# EAGLE design microSAT v6.0.1 (EAGLE 5.11)
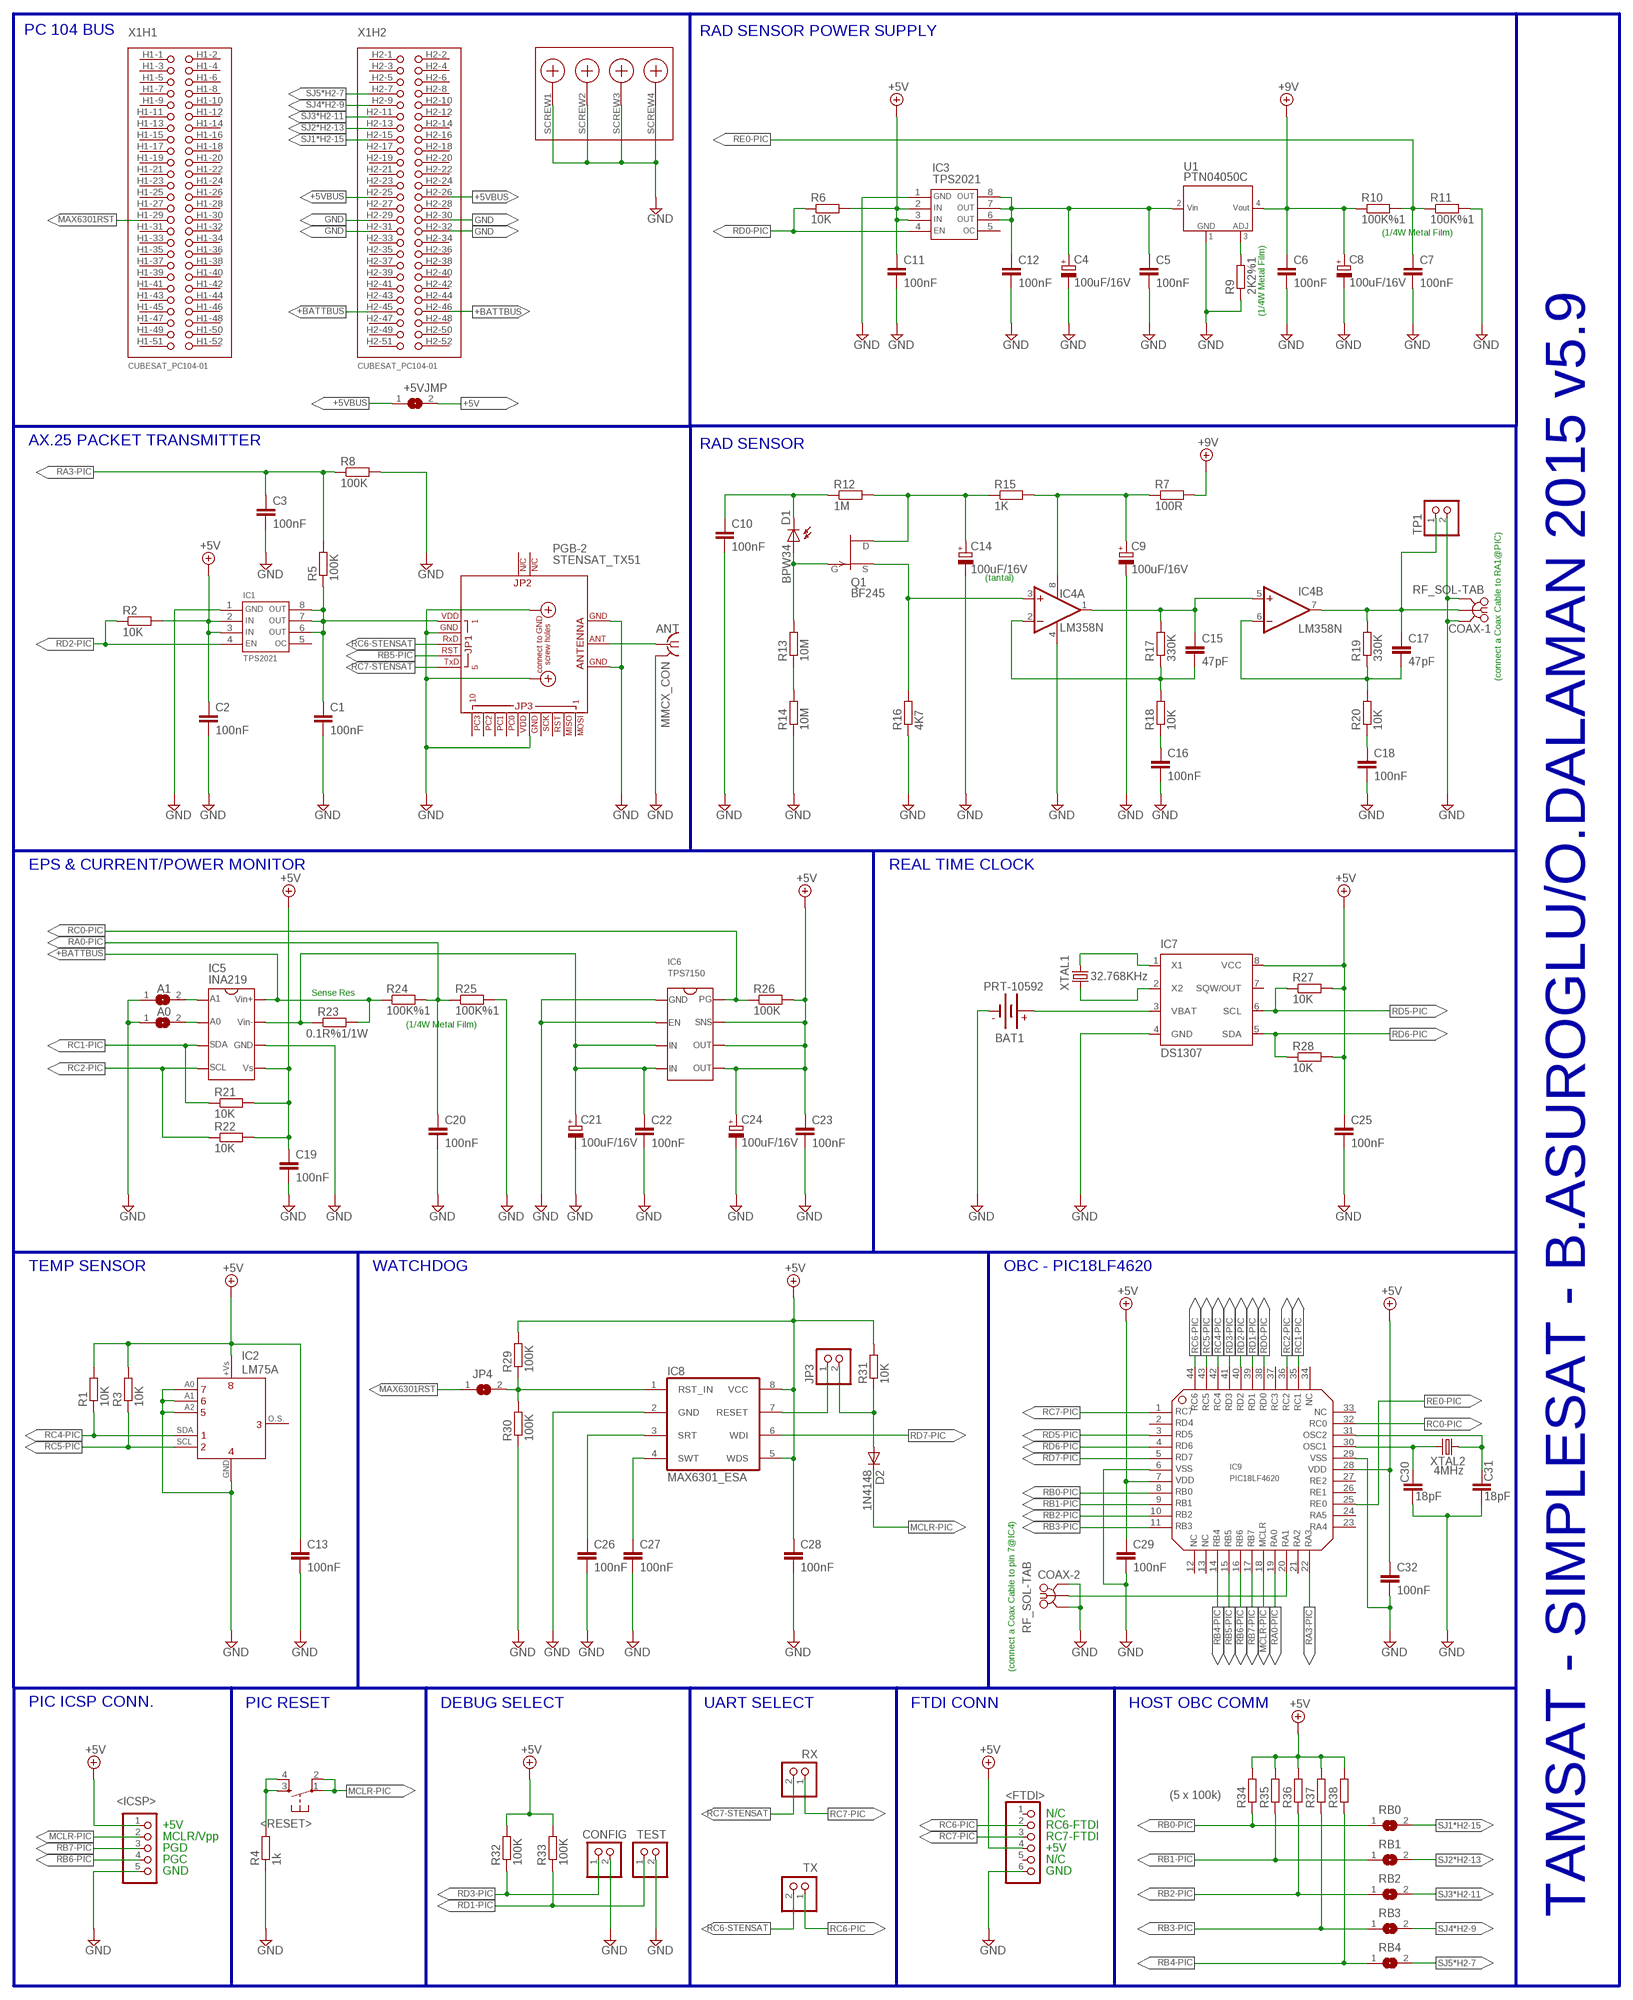
[diagram p0: schematic, sheet 1]

## Parts
+5VJMP  SJ  [SJ]
<FTDI>  PINHD-1X6-SP/90  [1X06/90]
<ICSP>  PINHD-1X5/90  [1X05/90]
<RESET>  TAC_SWITCHPTH  [TACTILE-PTH]
A0  SJ  [SJ]
A1  SJ  [SJ]
ANT  MMCX_CON  [MMCX]
BAT1  PRT-10592  BATTERY12MM  [BATTCON_12MM]
C1  100nF  C-EUC0805  [C0805]
C2  100nF  C-EUC0805  [C0805]
C3  100nF  C-EUC0805  [C0805]
C4  100uF/16V  CPOL-EUCT6032  [CT6032]
C5  100nF  C-EUC0805  [C0805]
C6  100nF  C-EUC0805  [C0805]
C7  100nF  C-EUC0805  [C0805]
C8  100uF/16V  CPOL-EUCT6032  [CT6032]
C9  100uF/16V  CPOL-EUCT6032  [CT6032]
C10  100nF  C-EUC0805  [C0805]
C11  100nF  C-EUC0805  [C0805]
C12  100nF  C-EUC0805  [C0805]
C13  100nF  C-EUC0805  [C0805]
C14  100uF/16V  CPOL-EUCT6032  [CT6032]
C15  47pF  C-EUC0805  [C0805]
C16  100nF  C-EUC0805  [C0805]
C17  47pF  C-EUC0805  [C0805]
C18  100nF  C-EUC0805  [C0805]
C19  100nF  C-EUC0805  [C0805]
C20  100nF  C-EUC0805  [C0805]
C21  100uF/16V  CPOL-EUCT6032  [CT6032]
C22  100nF  C-EUC0805  [C0805]
C23  100nF  C-EUC0805  [C0805]
C24  100uF/16V  CPOL-EUCT6032  [CT6032]
C25  100nF  C-EUC0805  [C0805]
C26  100nF  C-EUC0805  [C0805]
C27  100nF  C-EUC0805  [C0805]
C28  100nF  C-EUC0805  [C0805]
C29  100nF  C-EUC0805  [C0805]
C30  18pF  C-EUC0805K  [C0805K]
C31  18pF  C-EUC0805K  [C0805K]
C32  100nF  C-EUC0805  [C0805]
COAX-1  RF_SOL-TAB  [RF_SOL-TAB]
COAX-2  RF_SOL-TAB  [RF_SOL-TAB]
CONFIG  PINHD-1X2-SP/90  [1X02/90]
D1  BPW34  BPW32  [BPW32]
D2  1N4148  CGRM4001-G  [SOD-123_MINI-SMA]
IC1  TPS2021  [SOIC8]
IC2  LM75A  [SOIC8]
IC3  TPS2021  [SOIC8]
IC4  LM358N  [DIL08]
IC5  INA219  [SOIC8]
IC6  TPS7150  [SOIC8]
IC7  DS1307  [SOIC8]
IC8  MAX6301_ESA  [SO08]
IC9  PIC18LF4620  [TQFP44]
JP3  PINHD-1X2-SP  [1X02]
JP4  SJ  [SJ]
PGB-2  STENSAT_TX51  [STENSAT_TX51]
Q1  BF245  [TO92]
R1  10K  R-EU_R0805  [R0805]
R2  10K  R-EU_R0805  [R0805]
R3  10K  R-EU_R0805  [R0805]
R4  1k  R-EU_R0805  [R0805]
R5  100K  R-EU_M0805  [M0805]
R6  10K  R-EU_R0805  [R0805]
R7  100R  R-EU_M0805  [M0805]
R8  100K  R-EU_M0805  [M0805]
R9  2K2%1  R-EU_MELF0204W  [MINI_MELF-0204W]
R10  100K%1  R-EU_MELF0204R  [MINI_MELF-0204R]
R11  100K%1  R-EU_MELF0204R  [MINI_MELF-0204R]
R12  1M  R-EU_M0805  [M0805]
R13  10M  R-EU_M0805  [M0805]
R14  10M  R-EU_M0805  [M0805]
R15  1K  R-EU_M0805  [M0805]
R16  4K7  R-EU_M0805  [M0805]
R17  330K  R-EU_M0805  [M0805]
R18  10K  R-EU_M0805  [M0805]
R19  330K  R-EU_M0805  [M0805]
R20  10K  R-EU_M0805  [M0805]
R21  10K  R-EU_M0805  [M0805]
R22  10K  R-EU_M0805  [M0805]
R23  0.1R%1/1W  R-EU_R5025  [R5025]
R24  100K%1  R-EU_M0805  [M0805]
R25  100K%1  R-EU_M0805  [M0805]
R26  100K  R-EU_M0805  [M0805]
R27  10K  R-EU_M0805  [M0805]
R28  10K  R-EU_M0805  [M0805]
R29  100K  R-EU_M0805  [M0805]
R30  100K  R-EU_M0805  [M0805]
R31  10K  R-EU_M0805  [M0805]
R32  100K  R-EU_M0805  [M0805]
R33  100K  R-EU_M0805  [M0805]
R34  R-EU_M0805  [M0805]
R35  R-EU_M0805  [M0805]
R36  R-EU_M0805  [M0805]
R37  R-EU_M0805  [M0805]
R38  R-EU_M0805  [M0805]
RB0  SJ  [SJ]
RB1  SJ  [SJ]
RB2  SJ  [SJ]
RB3  SJ  [SJ]
RB4  SJ  [SJ]
RX  PINHD-1X2-SP/90  [1X02/90]
TEST  PINHD-1X2-SP/90  [1X02/90]
TP1  PINHD-1X2-SP  [1X02]
TX  PINHD-1X2-SP/90  [1X02/90]
U1  PTN04050C  [PTN04050C]
X1  CUBESAT_PC104-01  [PC104-PLUS]
XTAL1  32.768KHz  CRYSTALTC26H  [TC26H]
XTAL2  4MHz  CRYSTALHC49S  [HC49/S]

## Nets
+5V: +5VJMP.2 <FTDI>.4 <ICSP>.1 C2.1 C11.1 C13.1 C19.1 C23.1 C24.+ C25.1 C28.1 C29.1 C32.1 IC1.2 IC1.3 IC2.8 IC3.2 IC3.3 IC5.5 IC6.5 IC6.6 IC6.7 IC7.8(VCC) IC8.5(WDS) IC8.8(VCC) IC9.7 IC9.28 R1.2 R2.2 R3.2 R6.2 R21.2 R22.2 R26.2 R27.2 R28.2 R29.2 R31.2 R32.2 R33.2 R34.2 R35.2 R36.2 R37.2 R38.2
+5VBUS: +5VJMP.1 X1.H2-25 X1.H2-26
+9V: C6.1 C8.+ R7.2 R10.1 U1.P$4(VO)
+BATTBUS: IC5.8 R23.2 R24.1 X1.H2-45 X1.H2-46
GND: <FTDI>.6 <ICSP>.5 A0.1 A1.1 ANT.2(GND) BAT1.GND(-) C1.2 C2.2 C3.2 C4.- C5.2 C6.2 C7.2 C8.- C9.- C10.2 C11.2 C12.2 C13.2 C14.- C16.2 C18.2 C19.2 C20.2 C21.- C22.2 C23.2 C24.- C25.2 C26.2 C27.2 C28.2 C29.2 C30.2 C31.2 C32.2 COAX-1.P$2 COAX-1.P$3 COAX-2.P$2 COAX-2.P$3 CONFIG.2 IC1.1 IC2.4 IC2.5 IC2.6 IC2.7 IC3.1 IC4.4(P:V-) IC5.6 IC6.1 IC6.2 IC7.4(GND) IC8.2(GND) IC9.6 IC9.29 PGB-2.P$2 PGB-2.P$13 PGB-2.P$18 PGB-2.P$19 PGB-2.P$21 PGB-2.P$22 R4.1 R8.2 R9.1 R11.2 R14.1 R16.1 R25.2 R30.1 TEST.2 TP1.2 U1.P$1(GND) X1.H2-29 X1.H2-30 X1.H2-31 X1.H2-32 X1.SCREW1 X1.SCREW2 X1.SCREW3 X1.SCREW4
MAX6301RST: JP4.1 X1.H1-29
MCLR-PIC: <ICSP>.2 <RESET>.1 <RESET>.2 D2.C IC9.18
N$1: C1.1 IC1.6 IC1.7 IC1.8 PGB-2.P$1 R5.1
N$2: C4.+ C5.1 C12.1 IC3.6 IC3.7 IC3.8 U1.P$2(VI)
N$3: ANT.1 PGB-2.P$20
N$4: IC7.1(X1) XTAL1.1
N$5: R9.2 U1.P$3(ADJ)
N$6: C15.1 IC4.1(A:OUT) IC4.5(B:+IN) R17.2
N$7: C10.1 D1.K(C) R12.1
N$8: C14.+ Q1.1(D) R12.2 R15.1
N$9: <RESET>.3 <RESET>.4 R4.2
N$10: D1.A Q1.3(G) R13.2
N$11: R13.1 R14.2
N$12: C9.+ IC4.8(P:V+) R7.1 R15.2
N$13: IC4.3(A:+IN) Q1.2(S) R16.2
N$14: C15.2 IC4.2(A:-IN) R17.1 R18.2
N$15: C16.1 R18.1
N$16: C17.2 IC4.6(B:-IN) R19.1 R20.2
N$17: A1.2 IC5.1
N$18: A0.2 IC5.2
N$19: C18.1 R20.1
N$20: C21.+ C22.1 IC5.7 IC6.3 IC6.4 R23.1
N$21: IC7.2(X2) XTAL1.2
N$22: BAT1.PWR@2(+) IC7.3(VBAT)
N$23: C30.1 IC9.30 XTAL2.2
N$24: C31.1 IC9.31 XTAL2.1
N$25: IC8.1(RST_IN) JP4.2 R29.1 R30.2
N$26: C26.1 IC8.3(SRT)
N$27: C27.1 IC8.4(SWT)
N$28: IC8.7(RESET) JP3.1
N$29: D2.A JP3.2 R31.1
N$30: C17.1 COAX-1.P$1 IC4.7(B:OUT) R19.2 TP1.1
N$31: COAX-2.P$1 IC9.20
RA0-PIC: C20.1 IC9.19 R24.2 R25.1
RA3-PIC: C3.1 IC9.22 R5.2 R8.1
RB0-PIC: IC9.8 R34.1 RB0.1
RB1-PIC: IC9.9 R35.1 RB1.1
RB2-PIC: IC9.10 R36.1 RB2.1
RB3-PIC: IC9.11 R37.1 RB3.1
RB4-PIC: IC9.14 R38.1 RB4.1
RB5-PIC: IC9.15 PGB-2.P$4
RB6-PIC: <ICSP>.4 IC9.16
RB7-PIC: <ICSP>.3 IC9.17
RC0-PIC: IC6.8 IC9.32 R26.1
RC1-PIC: IC5.3 IC9.35 R21.1
RC2-PIC: IC5.4 IC9.36 R22.1
RC4-PIC: IC2.1 IC9.42 R1.1
RC5-PIC: IC2.2 IC9.43 R3.1
RC6-PIC: <FTDI>.2 IC9.44 TX.1
RC6-STENSAT: PGB-2.P$3 TX.2
RC7-PIC: <FTDI>.3 IC9.1 RX.1
RC7-STENSAT: PGB-2.P$5 RX.2
RD0-PIC: IC3.4 IC9.38 R6.1
RD1-PIC: IC9.39 R33.1 TEST.1
RD2-PIC: IC1.4 IC9.40 R2.1
RD3-PIC: CONFIG.1 IC9.41 R32.1
RD5-PIC: IC7.6(SCL) IC9.3 R27.1
RD6-PIC: IC7.5(SDA) IC9.4 R28.1
RD7-PIC: IC8.6(WDI) IC9.5
RE0-PIC: C7.1 IC9.25 R10.2 R11.1
SJ1*H2-15: RB0.2 X1.H2-15
SJ2*H2-13: RB1.2 X1.H2-13
SJ3*H2-11: RB2.2 X1.H2-11
SJ4*H2-9: RB3.2 X1.H2-9
SJ5*H2-7: RB4.2 X1.H2-7
Unconnected: <FTDI>.1 <FTDI>.5 IC1.5 IC2.3 IC3.5 IC7.7(SQW/OUT) IC9.2 IC9.12 IC9.13 IC9.21 IC9.23 IC9.24 IC9.26 IC9.27 IC9.33 IC9.34 IC9.37 PGB-2.P$6 PGB-2.P$7 PGB-2.P$8 PGB-2.P$9 PGB-2.P$10 PGB-2.P$11 PGB-2.P$12 PGB-2.P$14 PGB-2.P$15 PGB-2.P$16 PGB-2.P$17 X1.H1-1 X1.H1-2 X1.H1-3 X1.H1-4 X1.H1-5 X1.H1-6 X1.H1-7 X1.H1-8 X1.H1-9 X1.H1-10 X1.H1-11 X1.H1-12 X1.H1-13 X1.H1-14 X1.H1-15 X1.H1-16 X1.H1-17 X1.H1-18 X1.H1-19 X1.H1-20 X1.H1-21 X1.H1-22 X1.H1-23 X1.H1-24 X1.H1-25 X1.H1-26 X1.H1-27 X1.H1-28 X1.H1-30 X1.H1-31 X1.H1-32 X1.H1-33 X1.H1-34 X1.H1-35 X1.H1-36 X1.H1-37 X1.H1-38 X1.H1-39 X1.H1-40 X1.H1-41 X1.H1-42 X1.H1-43 X1.H1-44 X1.H1-45 X1.H1-46 X1.H1-47 X1.H1-48 X1.H1-49 X1.H1-50 X1.H1-51 X1.H1-52 X1.H2-1 X1.H2-2 X1.H2-3 X1.H2-4 X1.H2-5 X1.H2-6 X1.H2-8 X1.H2-10 X1.H2-12 X1.H2-14 X1.H2-16 X1.H2-17 X1.H2-18 X1.H2-19 X1.H2-20 X1.H2-21 X1.H2-22 X1.H2-23 X1.H2-24 X1.H2-27 X1.H2-28 X1.H2-33 X1.H2-34 X1.H2-35 X1.H2-36 X1.H2-37 X1.H2-38 X1.H2-39 X1.H2-40 X1.H2-41 X1.H2-42 X1.H2-43 X1.H2-44 X1.H2-47 X1.H2-48 X1.H2-49 X1.H2-50 X1.H2-51 X1.H2-52

## Buses
B$2

## Notes on the sheet
- PC 104 BUS | RAD SENSOR POWER SUPPLY
- (1/4W Metal Film)
- (1/4W Metal Film)
- AX.25 PACKET TRANSMITTER | RAD SENSOR
- (tantal)
- (connect a Coax Cable to RA1@PIC)
- EPS & CURRENT/POWER MONITOR | REAL TIME CLOCK
- Sense Res
- (1/4W Metal Film)
- TEMP SENSOR | WATCHDOG | OBC - PIC18LF4620
- (connect a Coax Cable to pin 7@IC4)
- PIC ICSP CONN. | PIC RESET | DEBUG SELECT | UART SELECT | FTDI CONN | HOST OBC COMM
- (5 x 100k)
- N/C
- +5V | RC6-FTDI
- MCLR/Vpp | RC7-FTDI
- PGD | +5V
- PGC | N/C
- GND | GND
- TAMSAT - SIMPLESAT - B.ASUROGLU/O.DALAMAN 2015 v5.9

## Power pins joined to a net without a drawn wire
GND: ANT.3(GND) ANT.4(GND) ANT.5(GND)

## Library data of the parts
+5VJMP A0 A1 JP4 RB0 RB1-RB4 = jumper:SJ: SMD solder JUMPER
<FTDI> = TAMSAT:PINHD-1X6-SP: PIN HEADER
<ICSP> = TAMSAT:PINHD-1X5: PIN HEADER
<RESET> = SparkFun:TAC_SWITCH: Momentary Switch Button commonly used for reset or general input. Spark Fun Electronics SKU : COM-00097
ANT = TAMSAT:MMCX_CON: FEMALE SMA CONNECTOR Radiall distributor RS 112-3794
BAT1 = SparkFun:BATTERY: Battery Holders Various common sizes : AA, AAA, 20mm coin cell and 12mm coin cell.
C1-C3 C5-C7 C10-C13 C15-C20 C22 C23 C25-C32 = rcl:C-EU: CAPACITOR, European symbol
C4 C9 C14 C21 C24 = rcl:CPOL-EU: POLARIZED CAPACITOR, European symbol
C8 = rcl-2:CPOL-EU: POLARIZED CAPACITOR, European symbol
COAX-1 COAX-2 = TAMSAT:RF_SOL-TAB
CONFIG JP3 RX TEST TP1 TX = TAMSAT:PINHD-1X2-SP: PIN HEADER
D1 = opto-trans-siemens:BPW32: PHOTO DIODE; OC_FARNELL: unknown; OC_NEWARK: unknown
D2 = diode:CGRM400*-G: Molded plasitc,JEDEC SOD-123/Mini SMA Source: Comchip CGRM4001-G.pdf
IC1 IC3 = Hurricane_Beacon:TPS2021
IC2 = TAMSAT:LM75A
IC4 = linear:LM358: OP AMP also LM158; LM258; LM2904 Source: http://cache.national.com/ds/LM/LM158.pdf
IC5 = TAMSAT:INA219: INA219, Texas Instruments, SO8 Package
IC6 = TAMSAT:TPS7150: TPS7150QD, Texas Instruments; Low-Dropout VReg, SO8
IC7 = TAMSAT:DS1307: 64 x 8, Serial, I2C Real-Time Clock Source: http://pdfserv.maxim-ic.com/en/ds/DS1307.pdf
IC8 = TAMSAT:MAX6301_ESA: VOLTAGE CONVERTER; MF: MAXIM; MPN: ICL7660CSA; OC_FARNELL: 9724710; OC_NEWARK: 34C3732
IC9 = TAMSAT:PIC18LF4620
PGB-2 = TAMSAT:STENSAT_TX51
Q1 = transistor-fet:BF245: N-Channel Junction FET http://www.onsemi.com/pub/Collateral/BF245A-D.PDF
R1-R6 R8-R38 = rcl:R-EU_: RESISTOR, European symbol
R7 = rcl-2:R-EU_: RESISTOR, European symbol
U1 = TAMSAT:PTN04050C
X1 = TAMSAT:CUBESAT_PC104: CUBESAT_PC/104
XTAL1 = crystal:CRYSTAL: CRYSTAL; OC_FARNELL: unknown; OC_NEWARK: unknown
XTAL2 = crystal:CRYSTAL: CRYSTAL; OC_FARNELL: 1667008; OC_NEWARK: unknown

## Board
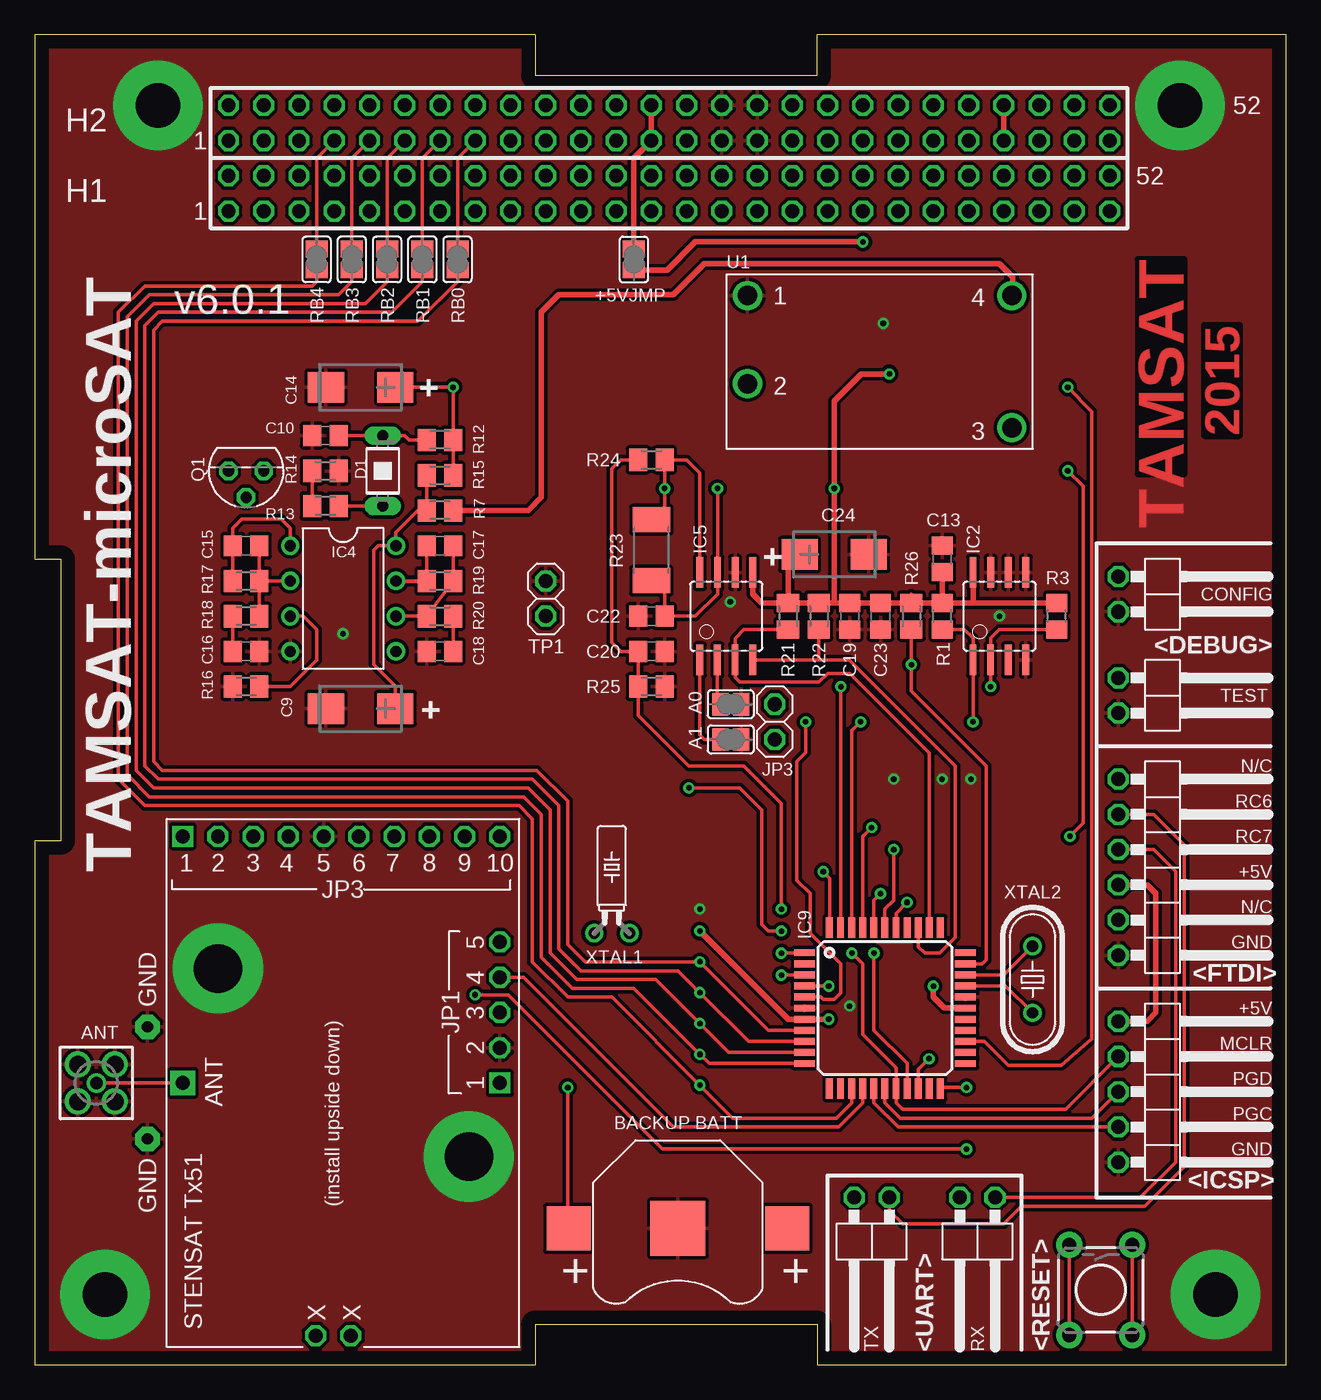
[diagram p1: board, top side]
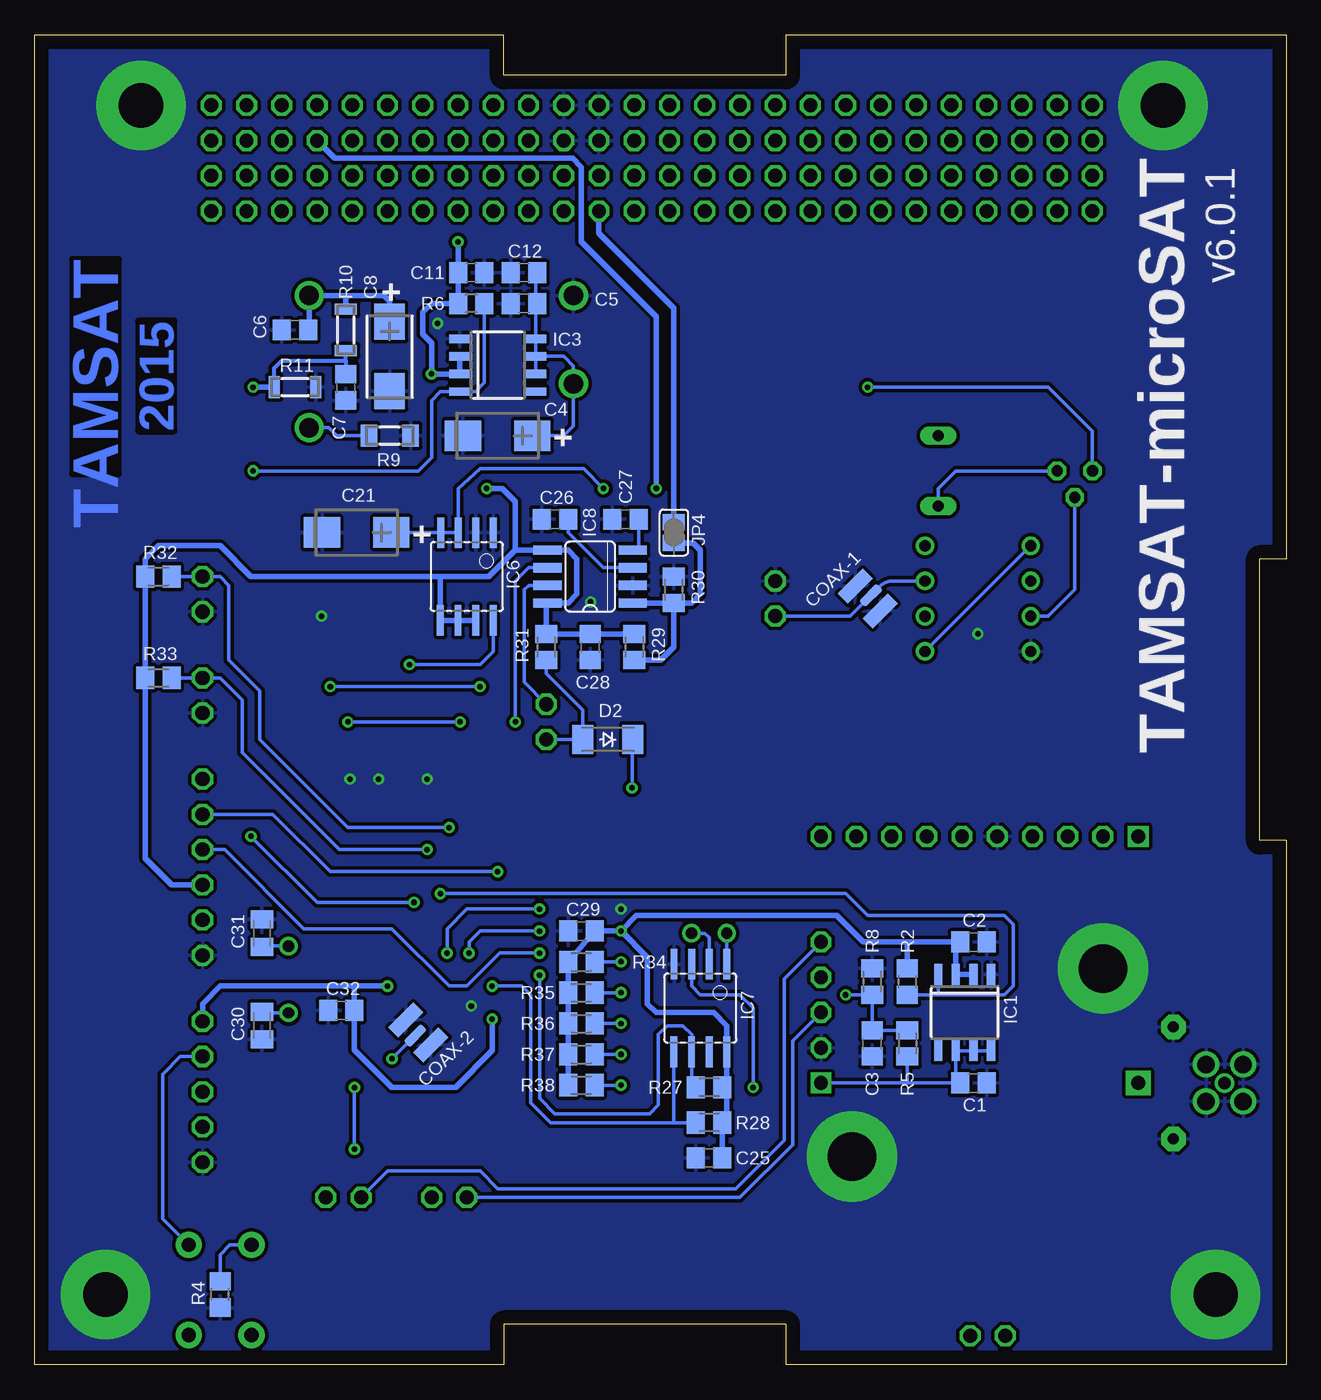
[diagram p2: board, bottom side, seen from below]

Size 90.2 x 95.9 mm. Coordinates in mm from the lower left corner, seen from the top.
Copper layers (1*16): Top 0.035mm / dielectric 1.5mm / Bottom 0.035mm
Design rules "default": minimum track width 10mil, minimum drill 24mil, track to track 8mil, track to pad 8mil, pad to pad 8mil, via to via 8mil, smd to smd 8mil, copper to edge 40mil, drill to drill 8mil, minimum pad ring 10mil, minimum via ring 8mil, stop-mask expansion 4mil, vias tented up to drill 0mil, thermal gap 10mil

### Footprints (pad centres in the part's own frame; a part is rotated, then mirrored left to right if it is on the bottom)
SJ = smd 1.168 x 1.6: 1 -0.762,0; 2 0.762,0
1X06/90 = drill 1.016 octagon: 1 -6.35,-3.81; 2 -3.81,-3.81; 3 -1.27,-3.81; 4 1.27,-3.81; 5 3.81,-3.81; 6 6.35,-3.81
1X05/90 = drill 1.016 octagon: 1 -5.08,-3.81; 2 -2.54,-3.81; 3 0,-3.81; 4 2.54,-3.81; 5 5.08,-3.81
TACTILE-PTH = drill 1.016 pad 1.88 round: 1 -3.251,2.261; 2 3.251,2.261; 3 -3.251,-2.261; 4 3.251,-2.261
MMCX = drill 0.9 pad 1.422 round: 1 0,0 | drill 1.25 pad 1.676 round: 2 -1.335,1.335; 3 1.335,1.335; 4 1.335,-1.335; 5 -1.335,-1.335
BATTCON_12MM = smd 3.962 x 3.962: GND 0,0 | smd 3.175 x 3.175: PWR@1 -7.874,0; PWR@2 7.874,0
C0805 = smd 1.3 x 1.5: 1 -0.95,0; 2 0.95,0
CT6032 = smd 2.6 x 2.2: + -2.5,0; - 2.5,0
CT6032' = smd 2.6 x 2.2: + 2.5,0; - -2.5,0
C0805K = smd 1.3 x 1.6: 1 -1,0; 2 1,0
RF_SOL-TAB = smd 1.778 x 0.635: P$1 0.318,0 | smd 2.54 x 1.016: P$2 0,1.27; P$3 0,-1.27
1X02/90 = drill 1.016 octagon: 1 -1.27,-3.81; 2 1.27,-3.81
BPW32 = drill 0.813 long: A 0,2.54; K 0,-2.54
SOD-123_MINI-SMA = smd 1.5 x 2.1: A 1.8,0; C -1.8,0
SOIC8 = smd 0.6 x 1.5: 1 -1.905,-2.75; 2 -0.635,-2.75; 3 0.635,-2.75; 4 1.905,-2.75; 5 1.905,2.75; 6 0.635,2.75; 7 -0.635,2.75; 8 -1.905,2.75
SOIC8' = smd 0.5 x 2.2: 1 -1.905,-3.154; 2 -0.645,-3.154; 3 0.625,-3.154; 4 1.895,-3.154; 5 1.905,3.154; 6 0.635,3.154; 7 -0.635,3.154; 8 -1.905,3.154
DIL08 = drill 0.813 pad 1.27 round: 1 -3.81,-3.81; 2 -1.27,-3.81; 3 1.27,-3.81; 4 3.81,-3.81; 5 3.81,3.81; 6 1.27,3.81; 7 -1.27,3.81; 8 -3.81,3.81
SO08 = smd 0.66 x 2.032: 1 -1.905,-3.073; 2 -0.635,-3.073; 3 0.635,-3.073; 4 1.905,-3.073; 5 1.905,3.073; 6 0.635,3.073; 7 -0.635,3.073; 8 -1.905,3.073
TQFP44 = smd 1.5 x 0.5: 1 -5.8,4; 2 -5.8,3.2; 3 -5.8,2.4; 4 -5.8,1.6; 5 -5.8,0.8; 6 -5.8,0; 7 -5.8,-0.8; 8 -5.8,-1.6; 9 -5.8,-2.4; 10 -5.8,-3.2; 11 -5.8,-4; 23 5.8,-4; 24 5.8,-3.2; 25 5.8,-2.4; 26 5.8,-1.6; 27 5.8,-0.8; 28 5.8,0; 29 5.8,0.8; 30 5.8,1.6; 31 5.8,2.4; 32 5.8,3.2; 33 5.8,4 | smd 0.5 x 1.5: 12 -4,-5.8; 13 -3.2,-5.8; 14 -2.4,-5.8; 15 -1.6,-5.8; 16 -0.8,-5.8; 17 0,-5.8; 18 0.8,-5.8; 19 1.6,-5.8; 20 2.4,-5.8; 21 3.2,-5.8; 22 4,-5.8; 34 4,5.8; 35 3.2,5.8; 36 2.4,5.8; 37 1.6,5.8; 38 0.8,5.8; 39 0,5.8; 40 -0.8,5.8; 41 -1.6,5.8; 42 -2.4,5.8; 43 -3.2,5.8; 44 -4,5.8
1X02 = drill 1.016 octagon: 1 -1.27,0; 2 1.27,0
STENSAT_TX51 = drill 1 square: P$1 0,-11.303; P$17 17.78,11.557 | drill 1 octagon: P$2 2.54,-11.303; P$3 5.08,-11.303; P$4 7.62,-11.303; P$5 10.16,-11.303; P$6 -18.212,-0.559; P$7 -18.212,1.981; P$8 17.78,-11.303; P$9 17.78,-8.763; P$10 17.78,-6.223; P$11 17.78,-3.683; P$12 17.78,-1.143; P$13 17.78,1.397; P$14 17.78,3.937; P$15 17.78,6.477; P$16 17.78,9.017 | drill 3.5 pad 6.5 round: P$18 -5.309,-9.068; P$19 8.255,9.017 | drill 1 pad 1.778 square: P$20 0,11.557 | drill 0.8 pad 1.778 octagon: P$21 -4.039,14.097; P$22 4.039,14.097
TO92 = drill 0.813 octagon: 1 1.27,0; 2 0,1.905; 3 -1.27,0
R0805 = smd 1.3 x 1.5: 1 -0.95,0; 2 0.95,0
M0805 = smd 1.3 x 1.6: 1 -0.95,0; 2 0.95,0
MINI_MELF-0204W = smd 1.2 x 1.6: 1 -1.5,0; 2 1.5,0
MINI_MELF-0204R = smd 0.8 x 1.6: 1 -1.5,0; 2 1.5,0
R5025 = smd 1.8 x 2.7: 1 -2.2,0; 2 2.2,0
PTN04050C = drill 1.4 round: P$1 1.524,11.049; P$2 1.524,4.699; P$3 20.574,1.524; P$4 20.574,11.049
PC104-PLUS = drill 1 octagon: H1-1 13.97,83.185; H1-2 13.97,85.725; H1-3 16.51,83.185; H1-4 16.51,85.725; H1-5 19.05,83.185; H1-6 19.05,85.725; H1-7 21.59,83.185; H1-8 21.59,85.725; H1-9 24.13,83.185; H1-10 24.13,85.725; H1-11 26.67,83.185; H1-12 26.67,85.725; H1-13 29.21,83.185; H1-14 29.21,85.725; H1-15 31.75,83.185; H1-16 31.75,85.725; H1-17 34.29,83.185; H1-18 34.29,85.725; H1-19 36.83,83.185; H1-20 36.83,85.725; H1-21 39.37,83.185; H1-22 39.37,85.725; H1-23 41.91,83.185; H1-24 41.91,85.725; H1-25 44.45,83.185; H1-26 44.45,85.725; H1-27 46.99,83.185; H1-28 46.99,85.725; H1-29 49.53,83.185; H1-30 49.53,85.725; H1-31 52.07,83.185; H1-32 52.07,85.725; H1-33 54.61,83.185; H1-34 54.61,85.725; H1-35 57.15,83.185; H1-36 57.15,85.725; H1-37 59.69,83.185; H1-38 59.69,85.725; H1-39 62.23,83.185; H1-40 62.23,85.725; H1-41 64.77,83.185; H1-42 64.77,85.725; H1-43 67.31,83.185; H1-44 67.31,85.725; H1-45 69.85,83.185; H1-46 69.85,85.725; H1-47 72.39,83.185; H1-48 72.39,85.725; H1-49 74.93,83.185; H1-50 74.93,85.725; H1-51 77.47,83.185; H1-52 77.47,85.725; H2-1 13.97,88.265; H2-2 13.97,90.805; H2-3 16.51,88.265; H2-4 16.51,90.805; H2-5 19.05,88.265; H2-6 19.05,90.805; H2-7 21.59,88.265; H2-8 21.59,90.805; H2-9 24.13,88.265; H2-10 24.13,90.805; H2-11 26.67,88.265; H2-12 26.67,90.805; H2-13 29.21,88.265; H2-14 29.21,90.805; H2-15 31.75,88.265; H2-16 31.75,90.805; H2-17 34.29,88.265; H2-18 34.29,90.805; H2-19 36.83,88.265; H2-20 36.83,90.805; H2-21 39.37,88.265; H2-22 39.37,90.805; H2-23 41.91,88.265; H2-24 41.91,90.805; H2-25 44.45,88.265; H2-26 44.45,90.805; H2-27 46.99,88.265; H2-28 46.99,90.805; H2-29 49.53,88.265; H2-30 49.53,90.805; H2-31 52.07,88.265; H2-32 52.07,90.805; H2-33 54.61,88.265; H2-34 54.61,90.805; H2-35 57.15,88.265; H2-36 57.15,90.805; H2-37 59.69,88.265; H2-38 59.69,90.805; H2-39 62.23,88.265; H2-40 62.23,90.805; H2-41 64.77,88.265; H2-42 64.77,90.805; H2-43 67.31,88.265; H2-44 67.31,90.805; H2-45 69.85,88.265; H2-46 69.85,90.805; H2-47 72.39,88.265; H2-48 72.39,90.805; H2-49 74.93,88.265; H2-50 74.93,90.805; H2-51 77.47,88.265; H2-52 77.47,90.805 | drill 3.2 pad 6.452 round: SCREW1 5.08,5.08; SCREW2 85.09,5.08; SCREW3 8.89,90.805; SCREW4 82.55,90.805
TC26H = drill 0.813 round: 1 -1.27,0; 2 1.27,0
HC49/S = drill 0.813 round: 1 -2.413,0; 2 2.413,0

### Placement (x,y rotation side)
+5VJMP  43.18,79.69 270 top
<FTDI>  81.92,35.88 270 top
<ICSP>  81.92,19.68 270 top
<RESET>  76.83,5.4 270 top
A0  50.16,47.62 180 top
A1  50.16,45.08 180 top
ANT  4.45,20.32 0 top
BAT1  46.35,9.84 180 top
C1  22.54,20.32 0 bottom
C2  22.54,30.48 0 bottom
C3  29.84,23.18 270 bottom
C4  56.83,66.99 180 bottom
C5  54.93,76.52 180 bottom
C6  71.44,74.61 180 bottom
C7  67.79,70.48 270 bottom
C8  100uF/16V  [CT6032']  64.61,72.71 90 bottom
C9  23.5,47.31 180 top
C10  20.95,66.99 180 top
C11  58.74,78.74 0 bottom
C12  54.93,78.74 180 bottom
C13  65.41,58.1 90 top
C14  23.5,70.48 180 top
C15  15.24,59.05 0 top
C16  15.24,51.44 0 top
C17  29.21,59.06 0 top
C18  29.21,51.44 180 top
C19  58.74,53.98 270 top
C20  44.45,51.44 0 top
C21  66.99,60.01 180 bottom
C22  44.45,53.98 180 top
C23  60.96,53.98 270 top
C24  57.63,58.42 0 top
C25  41.59,14.92 180 bottom
C26  52.7,60.96 180 bottom
C27  47.62,60.96 180 bottom
C28  50.16,51.75 270 bottom
C29  50.8,31.27 180 bottom
C30  73.82,24.45 270 bottom
C31  73.82,31.11 90 bottom
C32  68.1,25.56 180 bottom
COAX-1  30.16,55.24 45 bottom
COAX-2  62.55,23.97 225 bottom
CONFIG  81.92,55.56 270 top
D1  25.08,64.45 180 top
D2  48.9,45.09 180 bottom
IC1  23.18,25.4 180 bottom
IC2  LM75A  [SOIC8']  69.53,53.98 0 top
IC3  56.83,72.07 270 bottom
IC4  22.23,55.24 270 top
IC5  INA219  [SOIC8']  49.85,53.98 0 top
IC6  TPS7150  [SOIC8']  59.05,56.83 180 bottom
IC7  DS1307  [SOIC8']  42.23,25.72 180 bottom
IC8  50.16,56.83 90 bottom
IC9  61.28,25.72 0 top
JP3  53.34,46.35 270 top
JP4  44.13,60.01 270 bottom
PGB-2  22.23,20.32 90 top
Q1  15.24,64.45 180 top
R1  65.41,53.98 90 top
R2  27.3,27.62 90 bottom
R3  73.66,53.98 90 top
R4  76.84,5.08 90 bottom
R5  27.3,23.18 90 bottom
R6  58.74,76.52 180 bottom
R7  29.21,61.59 0 top
R8  29.84,27.62 90 bottom
R9  64.61,66.99 180 bottom
R10  67.79,74.61 270 bottom
R11  71.44,70.48 0 bottom
R12  29.21,66.67 0 top
R13  20.95,61.91 0 top
R14  20.95,64.45 180 top
R15  29.21,64.14 180 top
R16  15.24,48.9 0 top
R17  15.24,56.52 180 top
R18  15.24,53.98 0 top
R19  29.21,56.52 180 top
R20  29.21,53.98 180 top
R21  54.29,53.98 90 top
R22  56.52,53.98 90 top
R23  44.45,58.74 90 top
R24  44.45,65.25 180 top
R25  44.45,48.9 0 top
R26  63.18,53.98 90 top
R27  41.59,20 0 bottom
R28  41.59,17.46 0 bottom
R29  46.99,51.75 90 bottom
R30  44.13,55.88 270 bottom
R31  53.34,51.75 90 bottom
R32  81.28,56.83 180 bottom
R33  81.28,49.53 180 bottom
R34  50.8,29.05 180 bottom
R35  50.8,26.83 180 bottom
R36  50.8,24.61 180 bottom
R37  50.8,22.38 180 bottom
R38  50.8,20.16 180 bottom
RB0  30.48,79.69 90 top
RB1  27.94,79.69 90 top
RB2  25.4,79.69 90 top
RB3  22.86,79.69 90 top
RB4  20.32,79.69 90 top
RX  67.94,8.26 180 top
TEST  81.92,48.26 270 top
TP1  36.83,55.24 90 top
TX  60.33,8.26 180 top
U1  49.85,66.04 0 top
X1  0,0 0 top
XTAL1  41.59,31.11 0 top
XTAL2  71.91,27.78 270 top

### Tracks (layer width: path | path; a pad name or v marks a point on that pad's centre or on a via)
+5V  (via drill 0.4 pad 0.8)
  Top 0.254: R21.2 | 54.29,58.74 C24.+ | R26.2 63.18,55.56 63.82,54.92 | 57.63,54.92 57.78,54.92 | 67.63,54.92 | IC2.8 | R1.2
  Top 0.406: IC5.5 51.75,55.56 52.39,54.93 R21.2 | v47.94,31.27 54.3,24.92 IC9.7 57.14,24.92 v57.23,24.92 | <ICSP>.1 80.17,24.77 80.8,25.4 80.8,33.97 80.17,34.61 <FTDI>.4 | R26.2 C23.1 C19.1 57.78,54.92 R22.2 R21.2 54.29,58.74 | R1.2 67.63,54.92 | 67.63,54.92 R3.2 | 67.63,54.92 IC2.8 | 63.82,54.92 R1.2 | R1.2 C13.1 | +5VJMP.2 45.59,78.93 47.62,80.96 v59.69,80.96 | 57.63,54.92 v57.63,63.18 57.63,69.48 IC3.3 v61.59,71.44 | IC9.28 65.56,25.72 64.77,26.51 v64.77,27.3
  Bottom 0.254: R2.2 | 23.81,30.16 C2.1 | R32.2 | 40.32,17.46 R28.2 | 40.32,19.68 R27.2 | R33.2 | 27.3,30.48
  Bottom 0.406: IC6.7 IC6.6 IC6.5 60.96,56.2 60.96,56.83 | R38.2 R37.2 R36.2 R35.2 R34.2 C29.1 v47.94,31.27 | <FTDI>.4 80.33,34.61 82.23,36.51 R33.2 R32.2 | 23.81,30.16 IC1.3 IC1.2 | IC3.2 IC3.3 v61.59,71.44 61.59,73.66 62.23,74.3 62.23,75.88 61.59,76.52 R6.2 C11.1 v59.69,80.96 | R32.2 82.23,58.1 81.28,59.05 76.83,59.05 74.61,56.83 60.96,56.83 | 60.96,56.83 57.47,56.83 55.56,58.74 | 55.56,58.74 IC8.5 51.75,58.74 51.12,58.1 51.12,55.56 51.75,54.93 IC8.8 53.34,54.83 R31.2 C28.1 R29.2 | 55.56,58.74 55.56,62.23 56.52,63.18 v57.63,63.18 | C2.1 27.3,30.48 | 27.3,30.48 30.48,30.48 32.38,32.38 46.83,32.38 v47.94,31.27 | 27.3,30.48 R2.2 | 40.32,17.46 40.32,19.68 IC7.8 40.32,24.45 41.27,25.4 45.4,25.4 46.04,26.04 46.04,29.37 v47.94,31.27 | R28.2 C25.1 | 67.15,27.3 76.83,27.3 78.11,26.04 <ICSP>.1 | v57.23,24.92 57.23,22.65 59.85,20 64.45,20 67.15,22.7 C32.1 67.15,27.3 | 67.15,27.3 v64.77,27.3
+5VBUS
  Top 0.406: X1.H2-26 X1.H2-25 43.18,87 +5VJMP.1
+9V
  Top 0.254: 70.48,77.15 U1.P$4
  Top 0.406: R7.2 35.56,61.59 36.51,62.55 36.51,75.88 37.78,77.15 46.04,77.15 48.26,79.38 69.53,79.38 70.48,78.42 70.48,77.15
  Bottom 0.406: C6.1 70.42,74.86 U1.P$4 67.63,77.09 | 67.63,77.09 65.02,77.09 64.61,76.68 C8.+ | R10.1 67.79,76.93 67.63,77.09
+BATTBUS  (via drill 0.4 pad 0.8)
  Top 0.254: IC5.8 47.94,64.29 46.99,65.25 R24.1 45.4,65.4 v45.4,63.18 45.4,61.28 45.09,60.96 44.47,60.96 R23.2
  Top 0.406: X1.H2-45 X1.H2-46
  Bottom 0.406: X1.H2-45 68.58,87 51.44,87 50.8,86.36 50.8,80.96 45.4,75.56 v45.4,63.18
GND  (via drill 0.4 pad 0.8)
  other vias: 50.13,55 61.16,75.09 67.47,42.23 65.41,42.23 61.91,42.23 69.53,53.98 47.94,32.86 22.23,52.7 58.74,25.88
  pour Top (isolate 0.254): 0,95.89 36.04,95.89 36.04,93.03 56.36,93.03 56.36,95.89 90.17,95.89 90.17,0 56.36,0 56.36,2.86 36.04,2.86 36.04,0 0,0 0,37.78 1.91,37.78 1.91,58.1 0,58.1
  pour Bottom (isolate 0.254): 0,0 0,37.78 1.91,37.78 1.91,58.1 0,58.1 0,95.89 36.04,95.89 36.04,93.03 56.36,93.03 56.36,95.89 90.17,95.89 90.17,0 56.36,0 56.36,2.86 36.04,2.86 36.04,0
MAX6301RST
  Bottom 0.406: X1.H1-29 49.53,81.6 44.13,76.2 JP4.1
MCLR-PIC  (via drill 0.4 pad 0.8)
  Top 0.254: <RESET>.2 <RESET>.1 | <ICSP>.2 74.3,18.41 62.55,18.41 62.08,18.89 IC9.18 62.08,21.43 59.69,23.81 59.69,28.89 v58.9,29.69 | v47.15,41.59 50.8,41.59 52.39,40.01 52.39,31.75 52.86,31.27 v53.82,31.27
  Bottom 0.254: <ICSP>.2 79.69,22.23 80.96,20.95 80.96,10.52 <RESET>.1 | v47.15,41.59 47.15,45.03 D2.C | v58.9,29.69 58.9,30.48 58.1,31.27 v53.82,31.27
N$1
  Bottom 0.254: IC1.7 IC1.8 | 27.3,20.32 PGB-2.P$1 | IC1.7 | IC1.7 IC1.6 23.81,20.64 C1.1 27.3,20.32 | 27.3,20.32 R5.1
N$2
  Bottom 0.254: IC3.7 IC3.6 | IC3.7 IC3.8 54.08,76.52 | IC3.7 52.07,72.71 51.37,72.01 U1.P$2 51.37,67.69 52.07,66.99 C4.+ | 54.08,76.52 54.08,78.64 C12.1 | 54.08,76.52 C5.1
N$3
  Top 0.254: ANT.1 PGB-2.P$20
N$4
  Bottom 0.254: IC7.1 XTAL1.1
N$5
  Bottom 0.254: R9.2 68.42,66.99 68.99,67.56 U1.P$3
N$6
  Top 0.254: R17.2 C15.1 14.29,60.33 14.92,60.96 17.78,60.96 18.41,60.33 IC4.1
  Bottom 0.254: IC4.1 IC4.5
N$7
  Top 0.254: R12.1 26.99,66.67 26.67,66.99 D1.K C10.1
N$8  (via drill 0.4 pad 0.8)
  Top 0.254: R15.1 R12.2 v30.16,70.48 C14.+
  Bottom 0.254: Q1.1 13.97,67.31 17.14,70.48 v30.16,70.48
N$9
  Top 0.254: <RESET>.4 <RESET>.3
  Bottom 0.254: R4.2 76.83,7.94 76.12,8.65 <RESET>.3
N$10
  Top 0.254: D1.A R13.2
  Bottom 0.254: Q1.3 23.81,64.45 25.08,63.18 D1.A
N$11
  Top 0.254: R13.1 R14.2
N$12
  Top 0.254: R15.2 28.26,62.23 R7.1 27.62,61.59 26.04,60.01 IC4.8 24.77,59.05 24.45,58.74 24.45,50.48 26,48.94 C9.+
N$13
  Top 0.254: R16.2 18.41,48.9 20.32,50.8 20.32,53.02 19.37,53.98 IC4.3
  Bottom 0.254: Q1.2 15.24,55.88 17.14,53.98 IC4.3
N$14
  Top 0.254: R17.1 IC4.2 | R18.2 R17.1 | R17.1 C15.2
N$15
  Top 0.254: C16.1 R18.1
N$16
  Top 0.254: C17.2 R19.1 R20.2 IC4.6
N$17
  Top 0.254: IC5.1 47.94,45.4 48.26,45.09 49.09,45.09 A1.2
N$18
  Top 0.254: IC5.2 49.2,48.38 A0.2
N$19
  Top 0.254: C18.1 R20.1 | C18.1
N$20  (via drill 0.4 pad 0.8)
  Top 0.254: C22.1 47.62,53.98 49.21,55.56 IC5.7 v49.21,63.18 | C22.1 | C22.1 45.4,56.2 45.09,56.52 44.47,56.52 R23.1
  Bottom 0.254: C21.+ 64.47,59.99 IC6.4 IC6.3 59.68,63.19 58.1,64.61 50.64,64.61 v49.21,63.18
N$21
  Bottom 0.254: IC7.2 41.59,30.8 41.91,31.11 XTAL1.2
N$22  (via drill 0.4 pad 0.8)
  Top 0.254: v38.42,20 38.42,9.91 BAT1.PWR@2
  Bottom 0.254: IC7.3 42.86,27.3 42.23,26.67 39.37,26.67 38.42,25.72 v38.42,20
N$23
  Top 0.254: IC9.30 69.97,27.32 XTAL2.2
  Bottom 0.254: XTAL2.2 73.75,25.37 C30.1
N$24
  Top 0.254: IC9.31 69.84,28.12 XTAL2.1
  Bottom 0.254: XTAL2.1 73.75,30.19 C31.1
N$25
  Bottom 0.254: R30.2 | IC8.1 46.99,54.83
  Bottom 0.406: JP4.2 42.74,59.25 42.23,58.74 42.23,55.56 42.86,54.93 R30.2 IC8.1 | R29.1 45.08,50.8 44.13,51.75 R30.2
N$26
  Bottom 0.254: IC8.3 49.21,57.47 51.75,60.01 C26.1
N$27
  Bottom 0.254: C27.1 46.67,58.74 IC8.4
N$28
  Bottom 0.254: IC8.7 54.61,56.2 54.93,55.88 54.93,49.21 JP3.1
N$29
  Bottom 0.254: R31.1 53.34,49.85 50.7,47.2 D2.A JP3.2
N$30
  Top 0.254: R19.2 C17.1
  Top 0.305: IC4.7 R19.2
  Bottom 0.254: IC4.7 28.37,56.52 arc-45 29.27,56.14 COAX-1.P$1 31.43,53.98 TP1.1
N$31  (via drill 0.4)
  Top 0.254: IC9.20 63.68,21.29 v64.45,22.07
  Bottom 0.254: COAX-2.P$1 v64.45,22.07
RA0-PIC  (via drill 0.4 pad 0.8)
  Top 0.254: R25.1 C20.1 42.23,51.44 41.59,52.07 41.59,64.61 42.23,65.25 R24.2 | R25.1 | R25.1 43.5,46.83 47.15,43.18 51.12,43.18 53.82,40.48 v53.82,32.86 | IC9.19 62.88,21.74 60.48,24.13 v60.48,29.69
  Bottom 0.254: v60.48,29.69 60.48,31.43 59.05,32.86 v53.82,32.86
RA3-PIC  (via drill 0.4 pad 0.8)
  Top 0.254: v67.15,20 65.36,20 IC9.22 | v31.75,26.67 34.13,26.67 45.24,15.56 60.33,15.56 61.91,15.56 v67.15,15.56
  Bottom 0.254: R5.2 C3.1 R8.1 v31.75,26.67 | v67.15,15.56 v67.15,20
RB0-PIC  (via drill 0.4 pad 0.8)
  Top 0.254: IC9.8 52.88,24.12 v47.94,29.05 39.69,29.05 38.42,30.32 38.42,40.64 36.2,42.86 9.21,42.86 8.57,43.5 8.57,74.61 9.21,75.25 27.62,75.25 30.48,78.11 RB0.1
  Bottom 0.254: v47.94,29.05 R34.1
RB1-PIC  (via drill 0.4 pad 0.8)
  Top 0.254: IC9.9 51.45,23.32 v47.94,26.83 46.35,28.42 39.37,28.42 37.78,30 37.78,40.32 35.88,42.23 | RB1.1 27.94,78.11 25.72,75.88 8.89,75.88 7.94,74.93 7.94,43.18 8.89,42.23 35.88,42.23 | 35.88,42.23
  Bottom 0.254: v47.94,26.83 R35.1
RB2-PIC  (via drill 0.4 pad 0.8)
  Top 0.254: IC9.10 50.03,22.52 v47.94,24.61 44.77,27.78 39.05,27.78 37.15,29.69 37.15,40.01 35.56,41.59 8.57,41.59 7.3,42.86 7.3,75.25 8.57,76.52 23.81,76.52 25.4,78.11 RB2.1
  Bottom 0.254: v47.94,24.61 R36.1
RB3-PIC  (via drill 0.4 pad 0.8)
  Top 0.254: IC9.11 48.61,21.72 v47.94,22.38 43.18,27.15 38.73,27.15 36.51,29.37 36.51,39.69 35.24,40.96 8.26,40.96 6.67,42.55 6.67,75.56 8.26,77.15 21.91,77.15 22.86,78.11 RB3.1
  Bottom 0.254: v47.94,22.38 R37.1
RB4-PIC  (via drill 0.4 pad 0.8)
  Top 0.254: RB4.1 20.32,78.11 20,77.79 7.94,77.79 6.03,75.88 6.03,42.23 7.94,40.32 34.92,40.32 35.88,39.37 35.88,29.05 38.42,26.51 41.59,26.51 v47.94,20.16 50.32,17.78 57.78,17.78 58.88,18.87 IC9.14
  Bottom 0.254: v47.94,20.16 R38.1
RB5-PIC
  Top 0.254: IC9.15 59.69,19.91 59.69,18.89 57.94,17.14 46.04,17.14 35.24,27.94 PGB-2.P$4
RB6-PIC
  Top 0.254: IC9.16 60.48,18.9 62.23,17.14 <ICSP>.4
RB7-PIC
  Top 0.254: IC9.17 61.28,18.89 62.39,17.78 76.2,17.78 <ICSP>.3
RC0-PIC  (via drill 0.4 pad 0.8)
  Top 0.254: IC9.32 68.29,28.92 68.58,29.21 68.58,43.18 63.18,48.58 v63.18,50.48 R26.1
  Bottom 0.254: IC6.8 57.15,51.44 58.1,50.48 v63.18,50.48
RC1-PIC
  Top 0.254: R21.1 51.12,53.02 50.47,52.38 IC5.3 50.47,49.54 50.8,49.21 56.52,49.21 57.15,49.85 58.74,49.85 64.48,44.11 IC9.35
RC2-PIC
  Top 0.254: IC9.36 63.68,30.14 64.14,29.69 65.25,29.69 66.36,30.8 66.36,43.18 58.72,50.82 56.52,50.82 | 56.52,50.82 IC5.4 | 56.52,50.82 R22.1
RC4-PIC  (via drill 0.4 pad 0.8)
  Top 0.254: R1.1 66.99,53.02 67.63,52.39 IC2.1 | IC2.1 | IC2.1 67.63,48.9 v67.63,46.35 | v59.53,46.35 58.9,45.72 58.9,31.54 IC9.42
  Bottom 0.254: v59.53,46.35 v67.63,46.35
RC5-PIC  (via drill 0.4 pad 0.8)
  Top 0.254: R3.1 69.53,53.02 68.9,52.39 68.9,50.83 IC2.2 v68.9,48.9 | v58.1,48.9 58.1,31.54 IC9.43
  Bottom 0.254: v58.1,48.9 v68.9,48.9
RC6-PIC  (via drill 0.4 pad 0.8)
  Top 0.254: IC9.44 57.31,31.55 57.31,35.08 v56.83,35.56 | <FTDI>.2 80.64,39.69 82.87,37.47 82.87,14.29 80.01,11.43 71.12,11.43 69.85,10.16 62.55,10.16 61.59,11.11 TX.1
  Bottom 0.254: v56.83,35.56 68.9,35.56 73.03,39.69 <FTDI>.2
RC6-STENSAT
  Bottom 0.254: PGB-2.P$3 35.56,23.37 35.56,15.88 39.37,12.06 TX.2
RC7-PIC  (via drill 0.4 pad 0.8)
  Top 0.254: RX.1 79.69,12.06 82.23,14.61 82.23,35.56 80.64,37.15 <FTDI>.3 | v53.82,29.69 55.45,29.69 IC9.1
  Bottom 0.254: v53.82,29.69 56.67,29.69 59.05,27.3 60.33,27.3 64.45,31.43 70.8,31.43 76.52,37.15 <FTDI>.3
RC7-STENSAT
  Bottom 0.254: PGB-2.P$5 36.2,27.81 36.2,16.19 39.69,12.7 56.83,12.7 58.1,13.97 64.77,13.97 RX.2
RD0-PIC  (via drill 0.4 pad 0.8)
  Top 0.254: v74.45,64.45 75.56,63.34 75.56,39.05 v74.61,38.1 | v62.87,33.34 62.08,32.55 IC9.38
  Bottom 0.254: R6.1 57.78,70.8 58.42,70.17 IC3.4 60.96,70.17 61.59,69.53 61.59,65.41 62.55,64.45 v74.45,64.45 | v74.61,38.1 69.85,33.34 v62.87,33.34
  Bottom 0.406: R6.1
RD1-PIC  (via drill 0.4 pad 0.8)
  Top 0.254: IC9.39 61.28,32.86 61.91,33.5 v61.91,37.15
  Bottom 0.254: TEST.1 R33.1 | TEST.1 | v61.91,37.15 68.26,37.15 75.25,44.13 75.25,47.94 76.83,49.53 TEST.1
RD2-PIC  (via drill 0.4 pad 0.8)
  Top 0.254: IC9.40 60.48,33.49 v60.96,33.97
  Bottom 0.254: R2.1 25.08,26.67 | 25.08,26.67 20.32,26.67 19.68,27.3 19.68,31.75 20.32,32.38 30.16,32.38 31.75,33.97 v60.96,33.97 | 25.08,26.67 IC1.4
RD3-PIC  (via drill 0.4 pad 0.8)
  Top 0.254: IC9.41 59.68,38.09 v60.33,38.73
  Bottom 0.254: CONFIG.1 R32.1 | CONFIG.1 | v60.33,38.73 67.63,38.73 73.98,45.09 73.98,48.58 76.2,50.8 76.2,56.2 76.83,56.83 CONFIG.1
RD5-PIC  (via drill 0.4 pad 0.8)
  Top 0.254: v53.82,28.1 55.46,28.1 IC9.3
  Bottom 0.254: R27.1 42.86,20 IC7.6 42.86,23.81 43.5,24.45 44.61,24.45 45.24,23.81 45.24,18.73 45.88,18.1 52.7,18.1 53.82,19.21 v53.82,28.1
RD6-PIC  (via drill 0.4 pad 0.8)
  Top 0.254: IC9.4 55.49,27.3 v57.23,27.3
  Bottom 0.254: R28.1 44.13,17.46 | 44.13,17.46 53.02,17.46 54.45,18.89 54.45,26.67 55.09,27.3 v57.23,27.3 | 44.13,17.46 IC7.5
RD7-PIC  (via drill 0.4 pad 0.8)
  Top 0.254: IC9.5 56.67,26.52 56.83,26.35 57.63,26.36 58.1,26.83 58.1,28.89 55.88,31.11 55.88,33.97 54.93,34.92 54.93,43.5 55.56,44.13 v55.56,46.35
  Bottom 0.254: v55.56,46.35 55.56,56.52 54.61,57.47 IC8.6
RE0-PIC  (via drill 0.4 pad 0.8)
  Top 0.254: IC9.25 68.44,23.32 70.17,21.59 73.98,21.59 76.2,23.5 76.2,68.74 v74.45,70.48
  Bottom 0.305: 67.79,72.39 C7.1 | 67.79,72.39 R10.2 | R11.1 72.94,71.84 72.39,72.39 67.79,72.39
  Bottom 0.406: v74.45,70.48 R11.1
SJ1*H2-15
  Top 0.254: RB0.2 30.48,87 X1.H2-15
SJ2*H2-13
  Top 0.254: X1.H2-13 27.94,87 RB1.2
SJ3*H2-11
  Top 0.254: X1.H2-11 25.4,87 RB2.2
SJ4*H2-9
  Top 0.254: X1.H2-9 22.86,87 RB3.2
SJ5*H2-7
  Top 0.254: X1.H2-7 20.32,87 RB4.2

### Text on the board
Top: TAMSAT | 2015
Bottom: TAMSAT | 2015
tNames: TAMSAT-microSAT | v6.0.1 | + | + | <DEBUG> | + | N/C | RC6 | RC7 | +5V | N/C | GND | +5V | MCLR | PGD | PGC | BACKUP BATT | GND | + | + | <UART>
bNames: TAMSAT-microSAT | v6.0.1 | + | + | +